# Altium schematic sheet Sheet1.SchDoc
size A0
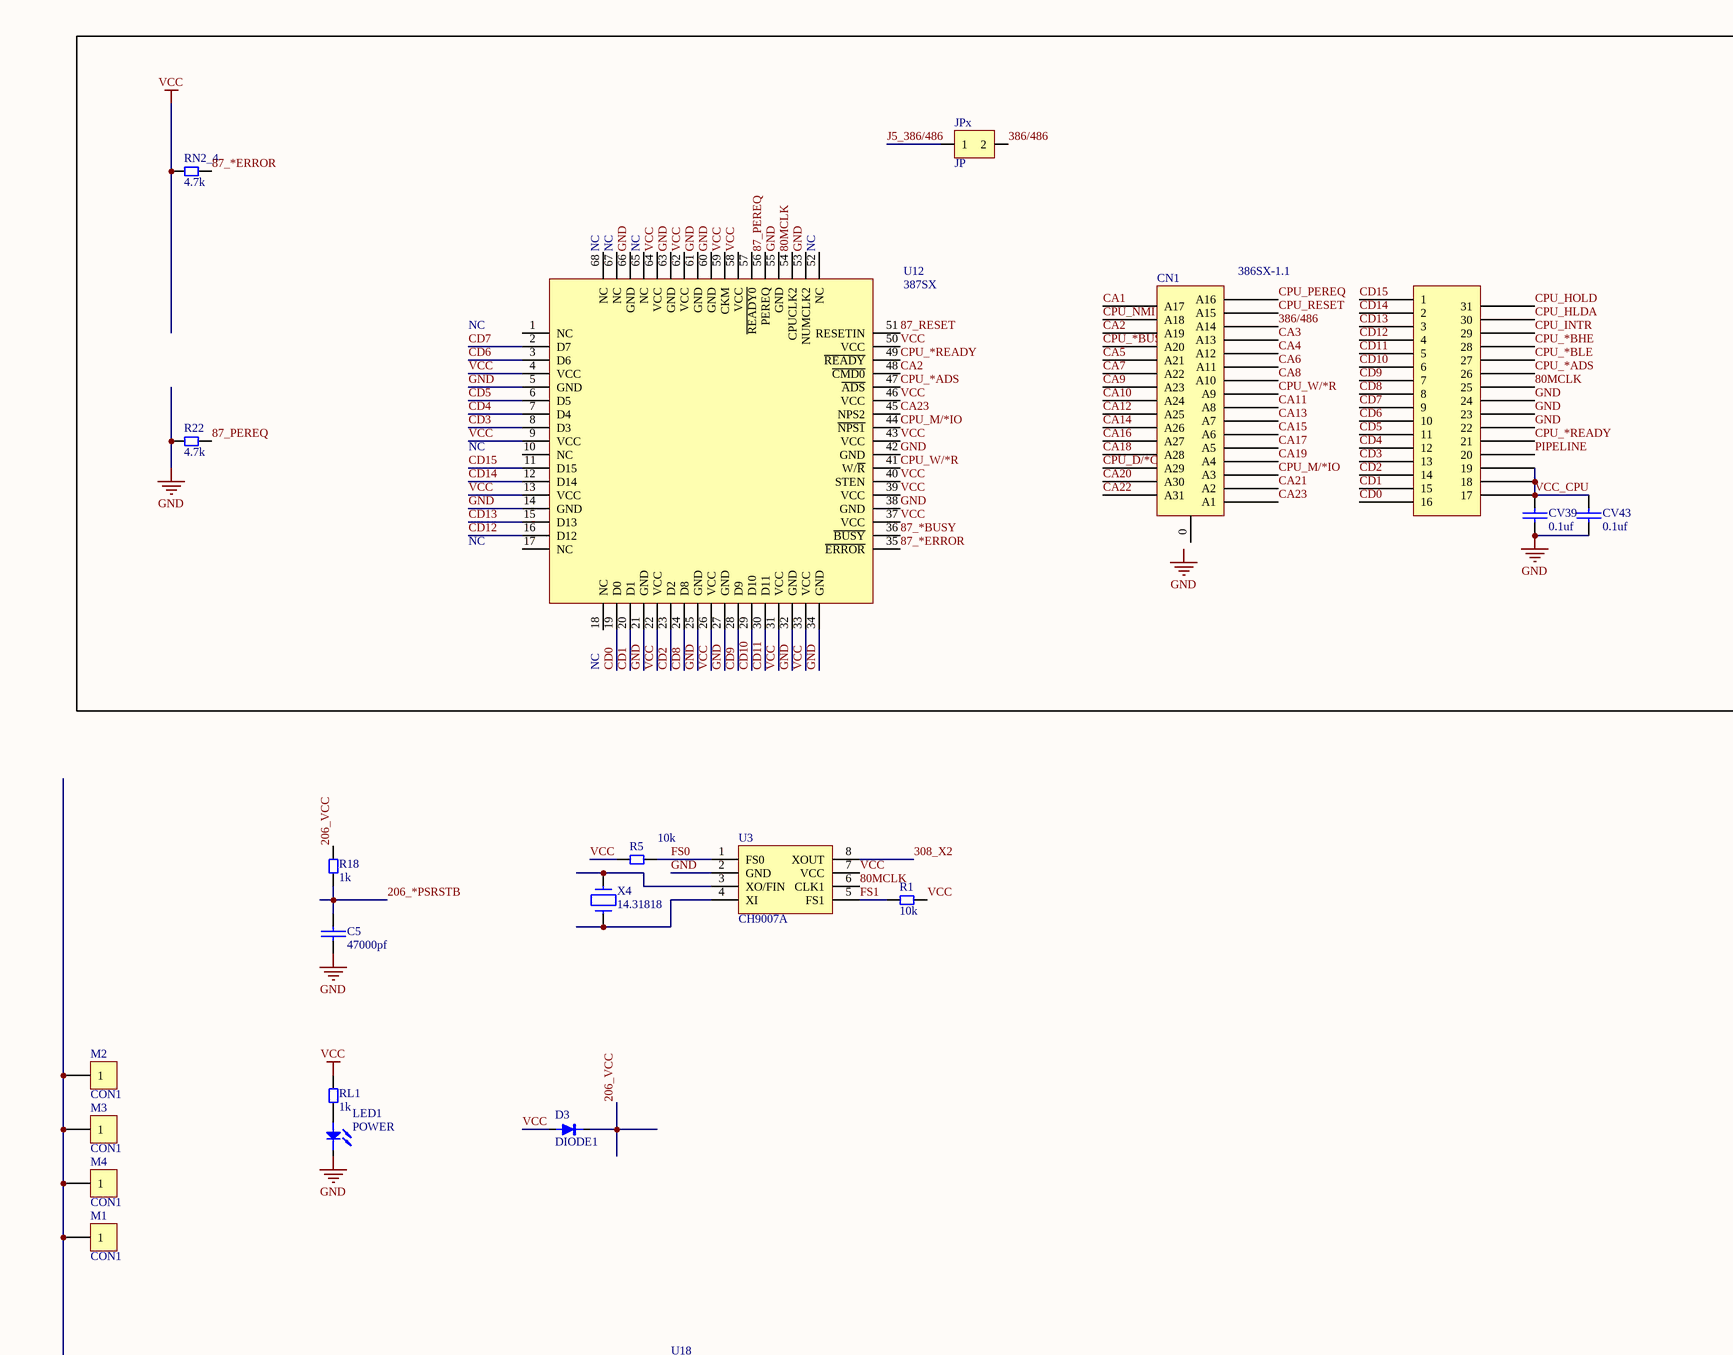
[diagram p0: Sheet1.SchDoc, top left]
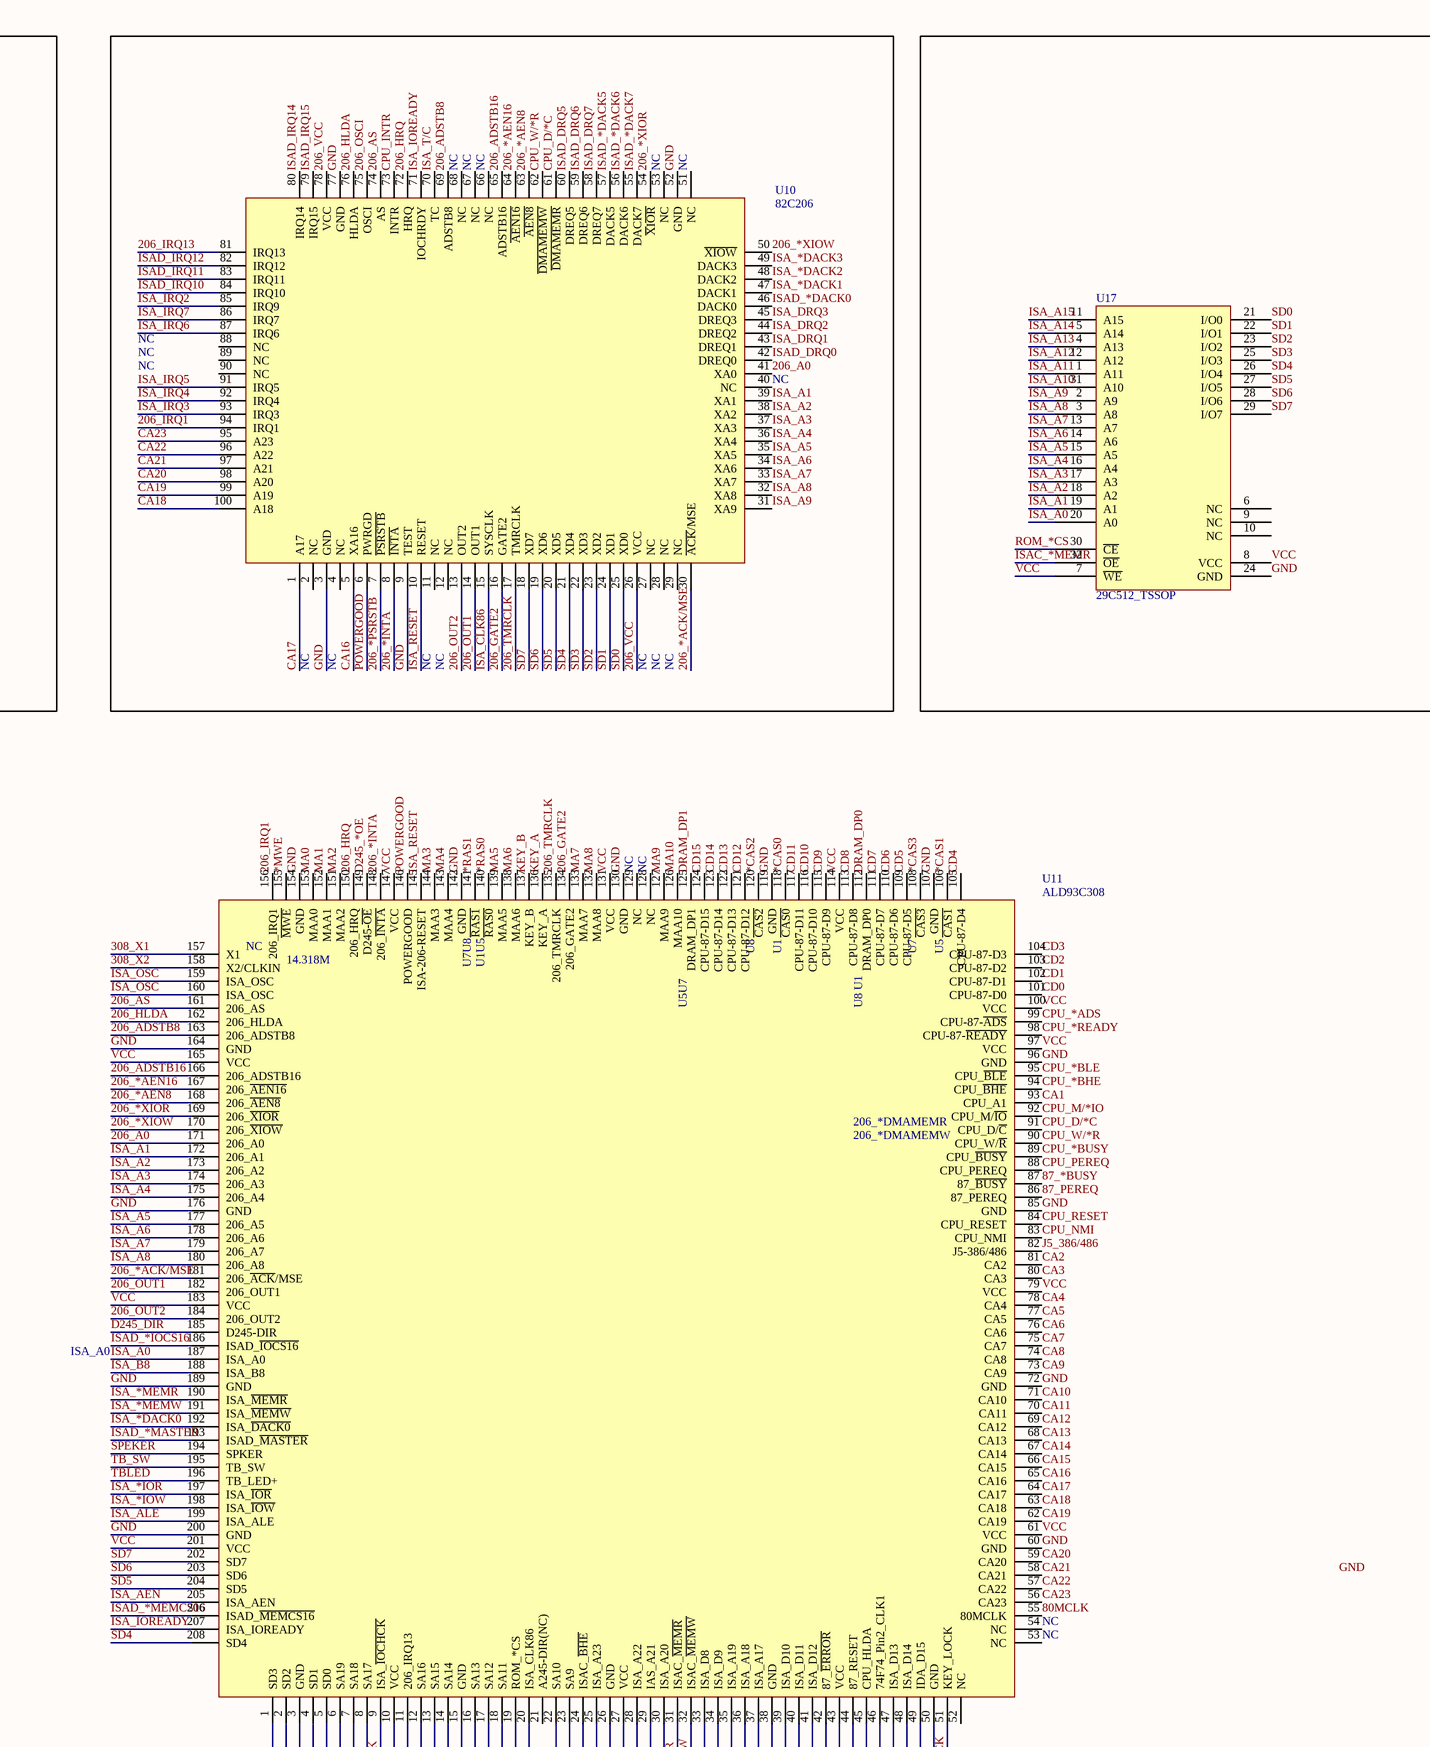
[diagram p1: Sheet1.SchDoc, top middle]
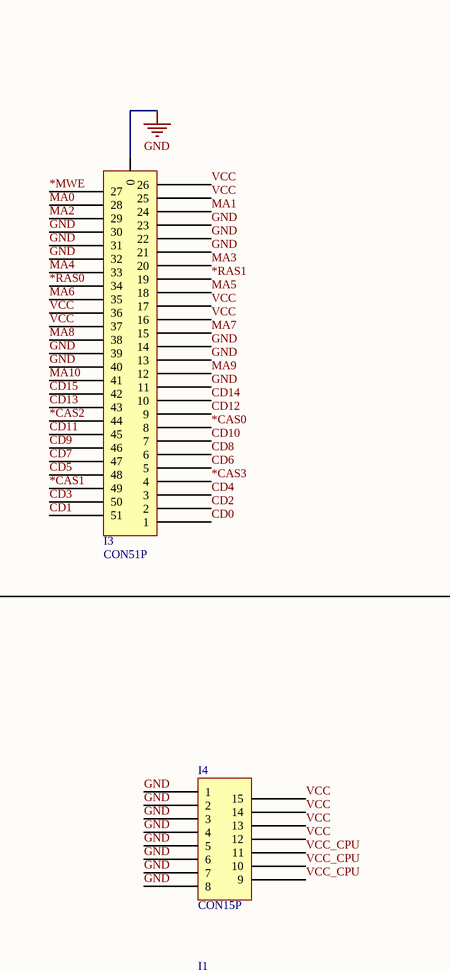
[diagram p2: Sheet1.SchDoc, top right]
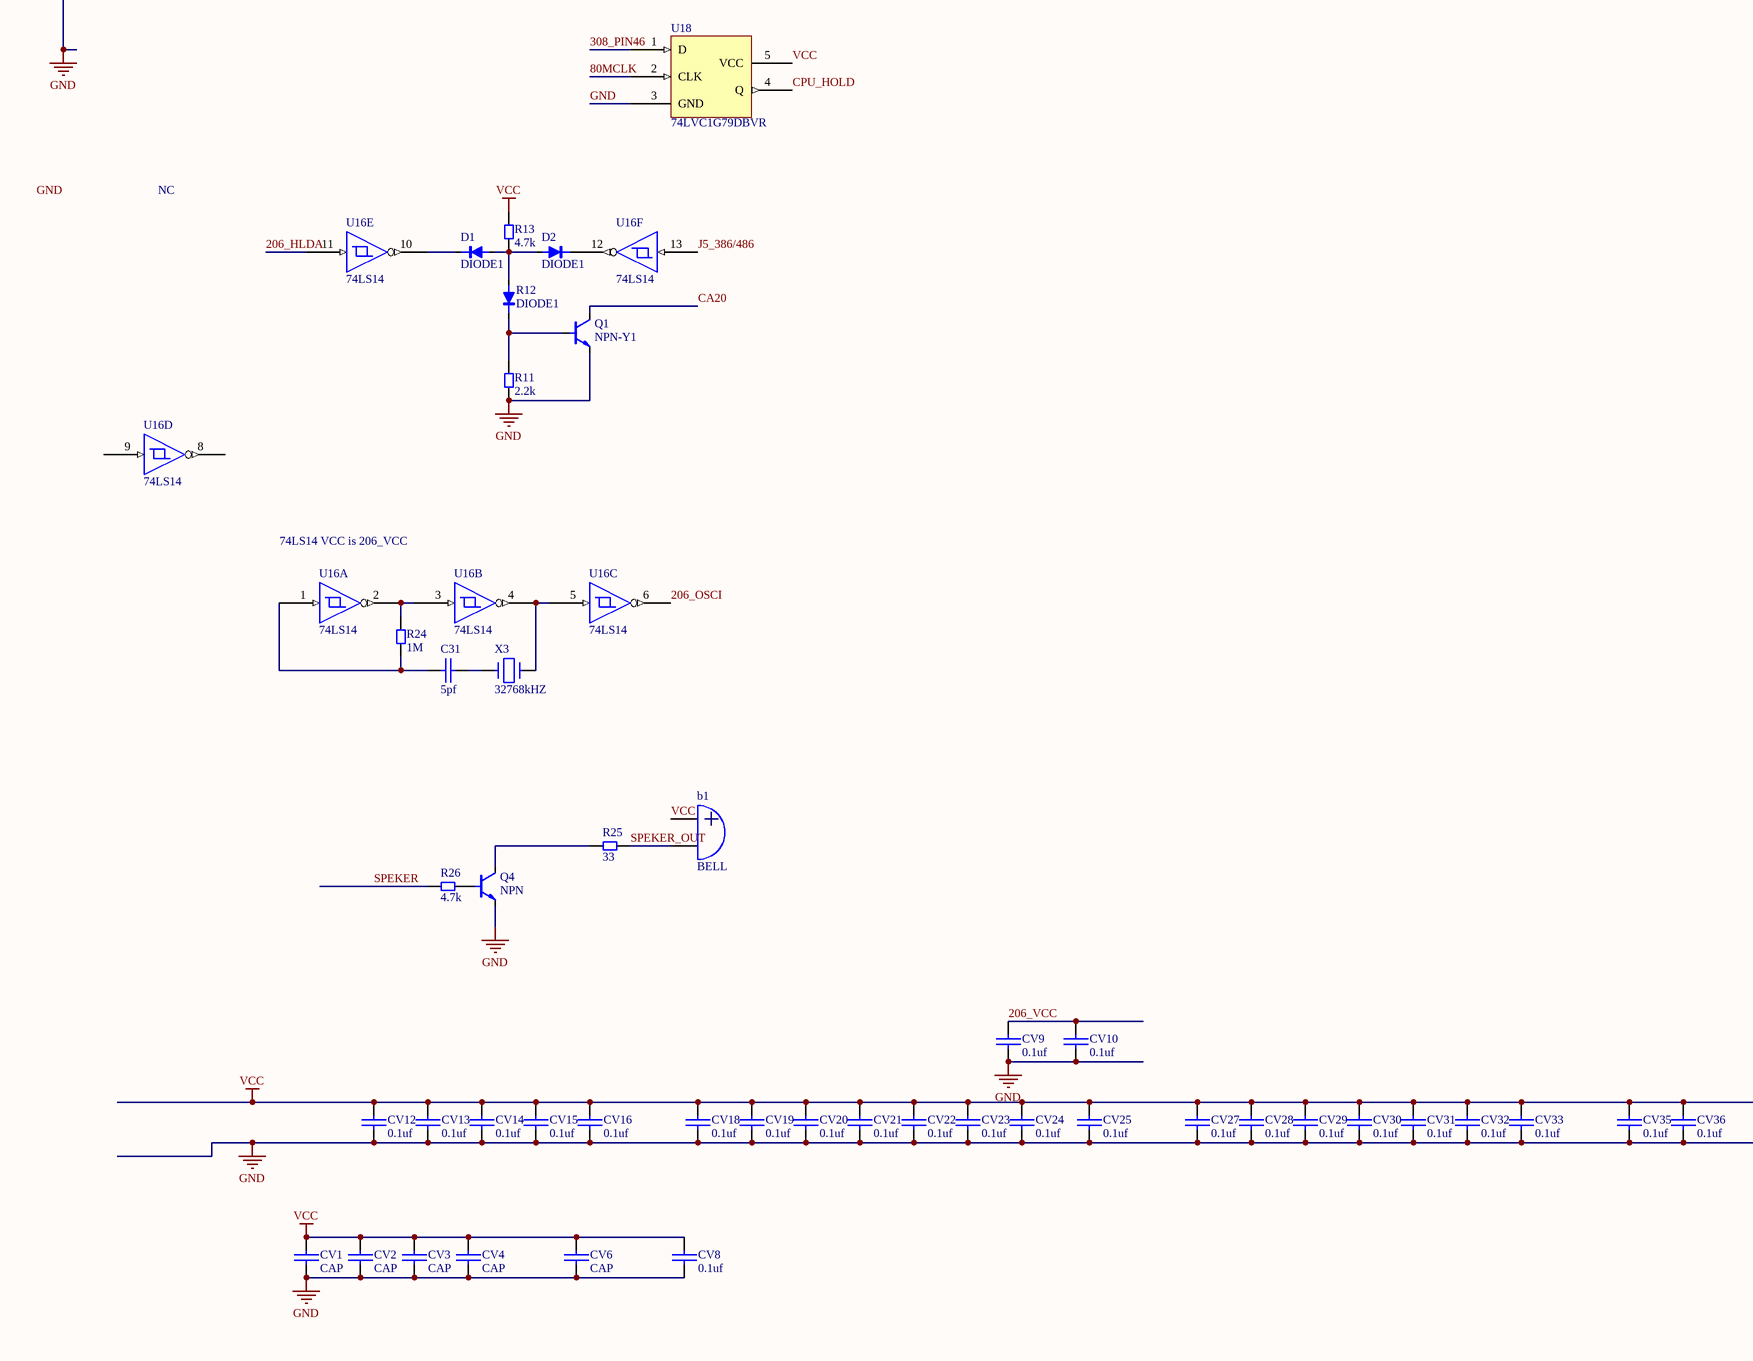
[diagram p3: Sheet1.SchDoc, bottom left]
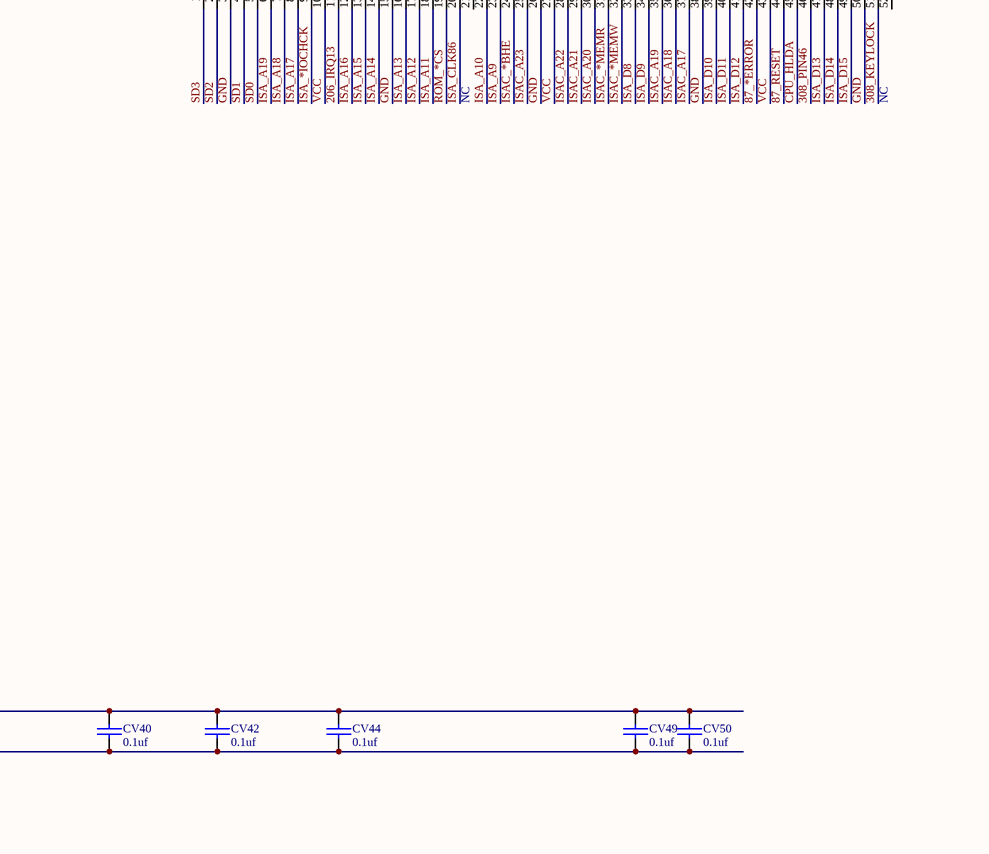
[diagram p4: Sheet1.SchDoc, bottom middle]
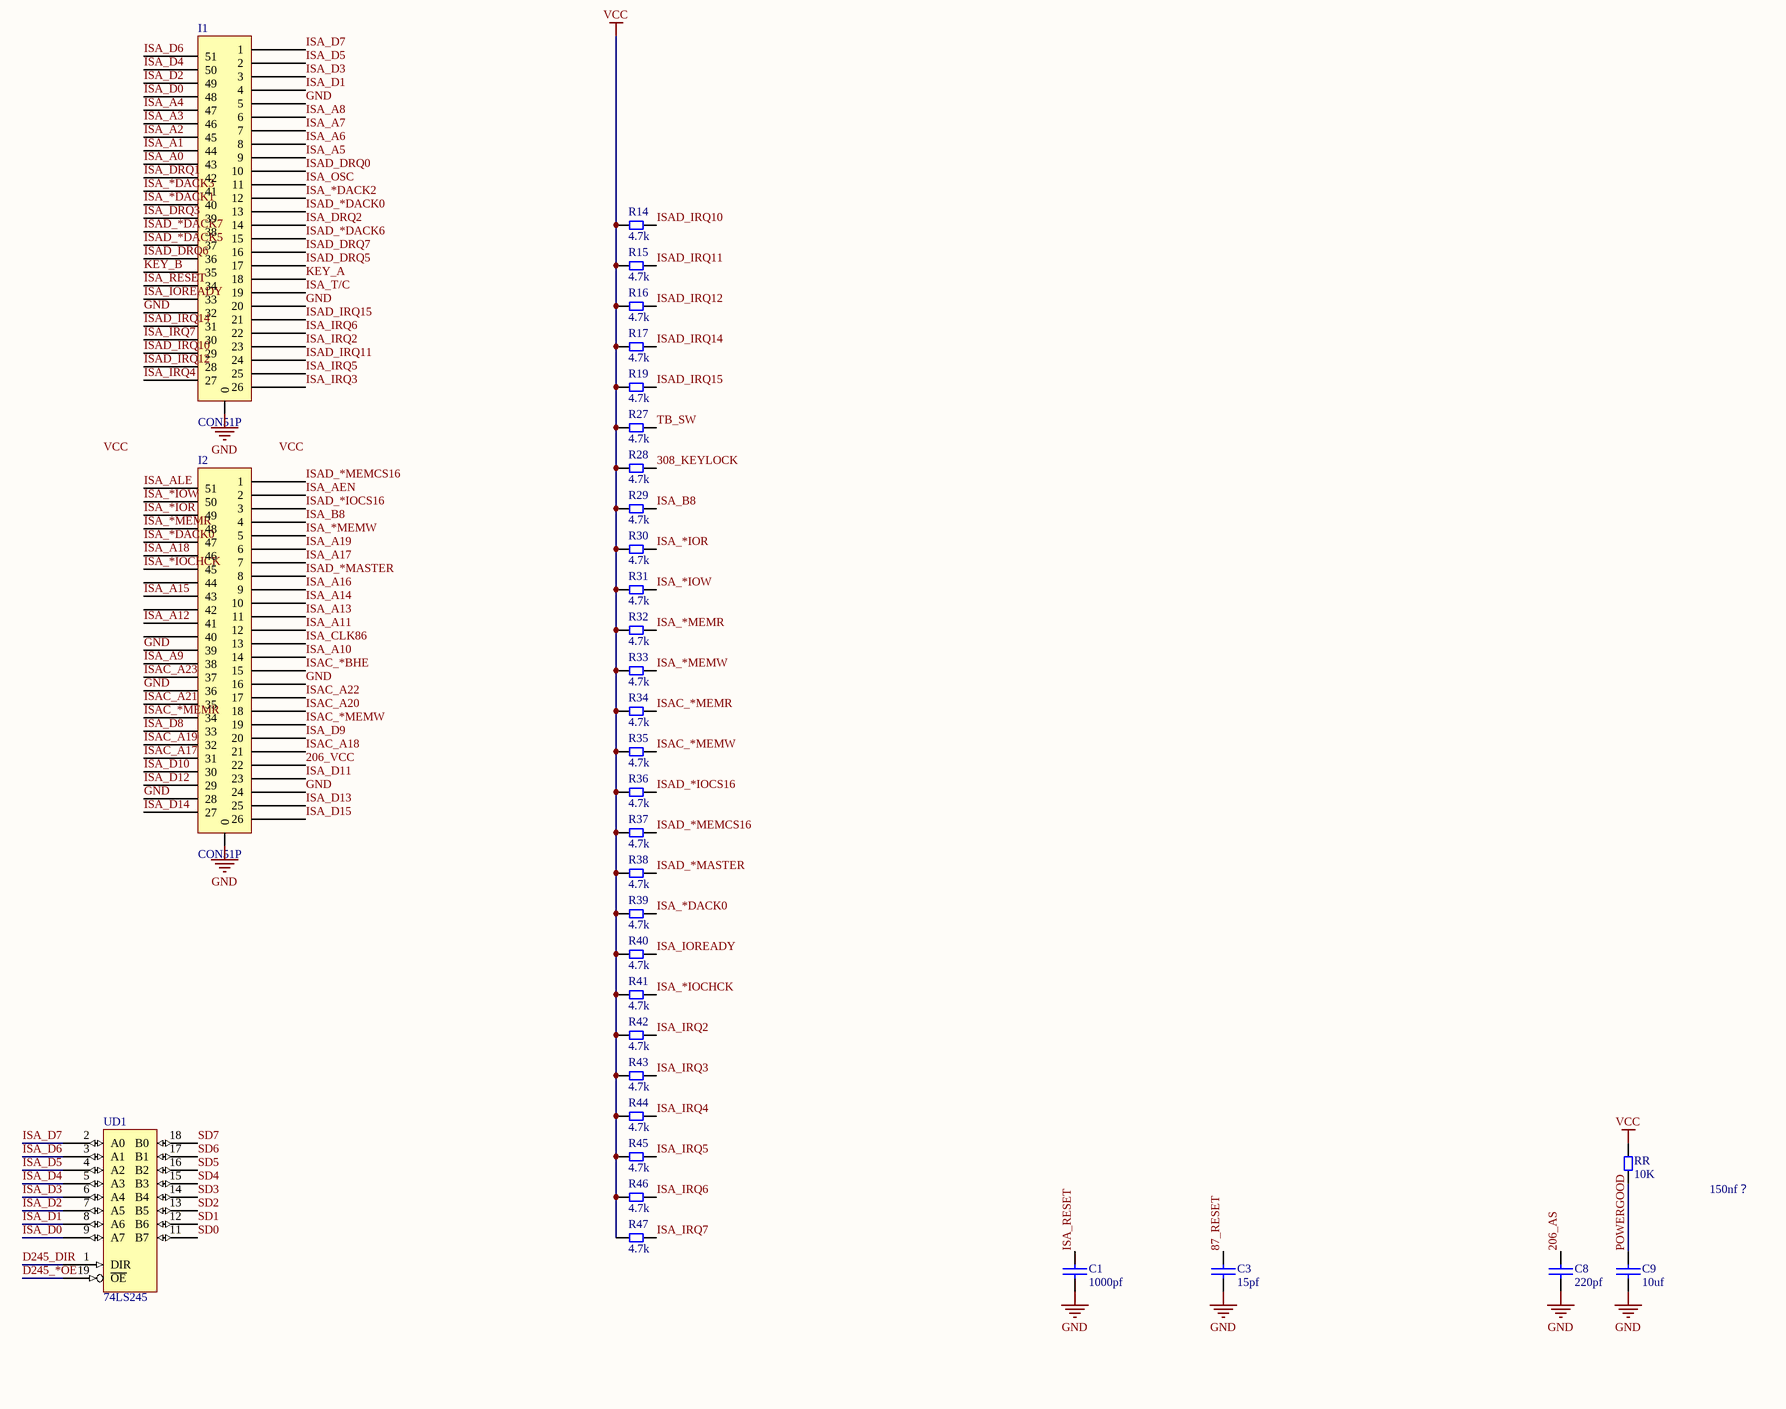
[diagram p5: Sheet1.SchDoc, bottom right]

## Parts
b1  BELL  [BELL_8530]
C1  1000pf  [C0603]
C3  15pf  [C0603]
C5  47000pf  [C0603]
C8  220pf  [C0603]
C9  10uf  [C0603]
C31  5pf  [C0603]
CN1  386SX-1.1  [MY-386SX1]
CV1  CAP  [C0805]
CV2  CAP  [C0805]
CV3  CAP  [C0805]
CV4  CAP  [C0805]
CV6  CAP  [C0805]
CV8  0.1uf  [C0603]
CV9  0.1uf  [C0603]
CV10  0.1uf  [C0603]
CV12  0.1uf  [C0603]
CV13  0.1uf  [C0603]
CV14  0.1uf  [C0603]
CV15  0.1uf  [C0603]
CV16  0.1uf  [C0603]
CV18  0.1uf  [C0603]
CV19  0.1uf  [C0603]
CV20  0.1uf  [C0603]
CV21  0.1uf  [C0603]
CV22  0.1uf  [C0603]
CV23  0.1uf  [C0603]
CV24  0.1uf  [C0603]
CV25  0.1uf  [C0603]
CV27  0.1uf  [C0603]
CV28  0.1uf  [C0603]
CV29  0.1uf  [C0603]
CV30  0.1uf  [C0603]
CV31  0.1uf  [C0603]
CV32  0.1uf  [C0603]
CV33  0.1uf  [C0603]
CV35  0.1uf  [C0603]
CV36  0.1uf  [C0603]
CV39  0.1uf  [C0603]
CV40  0.1uf  [C0603]
CV42  0.1uf  [C0603]
CV43  0.1uf  [C0603]
CV44  0.1uf  [C0603]
CV49  0.1uf  [C0603]
CV50  0.1uf  [C0603]
D1  DIODE1  [SOD323]
D2  DIODE1  [SOD323]
D3  DIODE1  [SMx]
I1  CON51P  [BTB1.0-51P-b]
I2  CON51P  [BTB1.0-51P-b]
I3  CON51P  [BTB1.0-51P-b]
I4  CON15P  [BTB1.0-15P-B]
JPx  JP  [SIP2(2.0)]
LED1  POWER  [LED0603]
M1  CON1  [M2A]
M2  CON1  [MY-M2]
M3  CON1  [MY-M2]
M4  CON1  [M2A]
Q1  NPN-Y1  [SOT23]
Q4  NPN  [SOT23]
R1  10k  [R0603]
R5  10k  [R0603]
R11  2.2k  [R0603]
R12  DIODE1  [SOD323]
R13  4.7k  [R0603]
R14  4.7k  [R0603]
R15  4.7k  [R0603]
R16  4.7k  [R0603]
R17  4.7k  [R0603]
R18  1k  [R0603]
R19  4.7k  [R0603]
R22  4.7k  [R0603]
R24  1M  [R0603]
R25  33  [R0603]
R26  4.7k  [R0603]
R27  4.7k  [R0603]
R28  4.7k  [R0603]
R29  4.7k  [R0603]
R30  4.7k  [R0603]
R31  4.7k  [R0603]
R32  4.7k  [R0603]
R33  4.7k  [R0603]
R34  4.7k  [R0603]
R35  4.7k  [R0603]
R36  4.7k  [R0603]
R37  4.7k  [R0603]
R38  4.7k  [R0603]
R39  4.7k  [R0603]
R40  4.7k  [R0603]
R41  4.7k  [R0603]
R42  4.7k  [R0603]
R43  4.7k  [R0603]
R44  4.7k  [R0603]
R45  4.7k  [R0603]
R46  4.7k  [R0603]
R47  4.7k  [R0603]
RL1  1k  [R0603]
RN2_4  4.7k  [R0603]
RR  10K  [R0603]
U3  CH9007A  [DIP8 - SOJ]
U10  82C206  [PQFP100B]
U11  ALD93C308
U12  387SX  [PLCC68]
U16  74LS14  [SO-14]  (parts A,B,C,D,E,F of 6)
U17  29C512_TSSOP  [TSSOP32]
U18  74LVC1G79DBVR  [SOT23-5]
UD1  74LS245  [TSSOP-20]
X3  32768kHZ  [CRY3215A]
X4  14.31818  [5032]

## Nets
GND: C1.2 C3.2 C5.1 C8.2 C9.2 CN1.22 CN1.23 CN1.24 CV1.2 CV2.2 CV3.2 CV4.2 CV6.2 CV8.2 CV9.2 CV10.2 CV12.2 CV13.2 CV14.2 CV15.2 CV16.2 CV18.2 CV19.2 CV20.2 CV21.2 CV22.2 CV23.2 CV24.2 CV25.2 CV27.2 CV28.2 CV29.2 CV30.2 CV31.2 CV32.2 CV33.2 CV35.2 CV36.2 CV39.2 CV40.2 CV42.2 CV43.2 CV44.2 CV49.2 CV50.2 I1.0 I1.5 I1.20 I1.32 I2.0 I2.16 I2.24 I2.28 I2.36 I2.39 I3.0 I3.11 I3.13 I3.14 I3.21 I3.22 I3.23 I3.30 I3.31 I3.32 I3.39 I3.40 I4.1 I4.2 I4.3 I4.4 I4.5 I4.6 I4.7 I4.8 LED1.2 M1.1 M2.1 M3.1 M4.1 Q1.E(e) Q4.E(e) R11.1 R22.1 U3.2(GND) U10.3(GND) U10.9(TEST) U10.52(GND) U10.77(GND) U11.3(GND) U11.15(GND) U11.26(GND) U11.38(GND) U11.50(GND) U11.60(GND) U11.72(GND) U11.85(GND) U11.96(GND) U11.107(GND) U11.119(GND) U11.130(GND) U11.142(GND) U11.154(GND) U11.164(GND) U11.176(GND) U11.189(GND) U11.200(GND) U12.5(GND) U12.14(GND) U12.21(GND) U12.25(GND) U12.27(GND) U12.32(GND) U12.34(GND) U12.38(GND) U12.42(GND) U12.53(NUMCLK2) U12.55(GND) U12.60(GND) U12.61(GND) U12.63(GND) U12.66(GND) U16.7(GND) U17.24(GND) U18.3(GND) UD1.10(GND)
VCC: b1.1 CV1.1 CV2.1 CV3.1 CV4.1 CV6.1 CV8.1 CV12.1 CV13.1 CV14.1 CV15.1 CV16.1 CV18.1 CV19.1 CV20.1 CV21.1 CV22.1 CV23.1 CV24.1 CV25.1 CV27.1 CV28.1 CV29.1 CV30.1 CV31.1 CV32.1 CV33.1 CV35.1 CV36.1 CV40.1 CV42.1 CV44.1 CV49.1 CV50.1 D3.A I3.16 I3.17 I3.25 I3.26 I3.36 I3.37 I4.12 I4.13 I4.14 I4.15 R1.2 R5.2 R13.1 R14.1 R15.1 R16.1 R17.1 R19.1 R27.1 R28.1 R29.1 R30.1 R31.1 R32.1 R33.1 R34.1 R35.1 R36.1 R37.1 R38.1 R39.1 R40.1 R41.1 R42.1 R43.1 R44.1 R45.1 R46.1 R47.1 RL1.2 RN2_4.2 RR.2 U3.7(VCC) U11.10(VCC) U11.27(VCC) U11.43(VCC) U11.61(VCC) U11.79(VCC) U11.97(VCC) U11.100(VCC) U11.114(VCC) U11.131(VCC) U11.147(VCC) U11.165(VCC) U11.183(VCC) U11.201(VCC) U12.4(VCC) U12.9(VCC) U12.13(VCC) U12.22(VCC) U12.26(VCC) U12.31(VCC) U12.33(VCC) U12.37(VCC) U12.39(VCC) U12.40(STEN) U12.43(VCC) U12.46(VCC) U12.50(VCC) U12.58(VCC) U12.59(CKM) U12.62(VCC) U12.64(VCC) U16.14(VCC) U17.7(~{WE}) U17.8(VCC) U18.5(VCC) UD1.20(VCC)
80MCLK: CN1.25 U3.6(CLK1) U11.55(80MCLK) U12.54(CPUCLK2) U18.2(CLK)
87_*BUSY: U11.87(87_~{BUSY}) U12.36(~{BUSY})
87_*ERROR: RN2_4.1 U11.42(87_~{ERROR}) U12.35(~{ERROR})
87_PEREQ: R22.2 U11.86(87_PEREQ) U12.56(PEREQ)
87_RESET: C3.1 U11.44(87_RESET) U12.51(RESETIN)
206_*ACK/MSE: U10.30(~{ACK}/MSE) U11.181(206_~{ACK}/MSE)
206_*AEN8: U10.63(~{AEN8}) U11.168(206_~{AEN8})
206_*AEN16: U10.64(~{AEN16}) U11.167(206_~{AEN16})
206_*INTA: U10.8(~{INTA}) U11.148(206_~{INTA})
206_*PSRSTB: C5.2 R18.1 U10.7(~{PSRSTB})
206_*XIOR: U10.54(~{X}I~{OR}) U11.169(206_~{XIOR})
206_*XIOW: U10.50(~{XIOW}) U11.170(206_~{XIOW})
206_A0: U10.41(XA0) U11.171(206_A0)
206_ADSTB8: U10.69(ADSTB8) U11.163(206_ADSTB8)
206_ADSTB16: U10.65(ADSTB16) U11.166(206_ADSTB16)
206_AS: C8.1 U10.74(AS) U11.161(206_AS)
206_GATE2: U10.16(GATE2) U11.134(206_GATE2)
206_HLDA: U10.76(HLDA) U11.162(206_HLDA) U16.11
206_HRQ: U10.72(HRQ) U11.150(206_HRQ)
206_IRQ1: U10.94(IRQ1) U11.156(206_IRQ1)
206_IRQ13: U10.81(IRQ13) U11.11(206_IRQ13)
206_OSCI: U10.75(OSCI) U16.6
206_OUT1: U10.14(OUT1) U11.182(206_OUT1)
206_OUT2: U10.13(OUT2) U11.184(206_OUT2)
206_TMRCLK: U10.17(TMRCLK) U11.135(206_TMRCLK)
206_VCC: CV9.1 CV10.1 D3.K I2.22 R18.2 U10.26(VCC) U10.78(VCC)
308_KEYLOCK: R28.2 U11.51(KEY_LOCK)
308_PIN46: U11.46(74F74_Pin2_CLK1) U18.1(D)
308_X1: U11.157(X1)
308_X2: U3.8(XOUT) U11.158(X2/CLKIN)
386/486: CN1.A14 JPx.2
*CAS0: I3.8 U11.118(~{CAS0})
*CAS1: I3.49 U11.106(~{CAS1})
*CAS2: I3.44 U11.120(~{CAS2})
*CAS3: I3.4 U11.108(~{CAS3})
*MWE: I3.27 U11.155(~{MWE})
*RAS0: I3.34 U11.140(~{RAS0})
*RAS1: I3.19 U11.141(~{RAS1})
CA1: CN1.A17 U11.93(CPU_A1)
CA2: CN1.A19 U11.81(CA2) U12.48(~{CMD0})
CA3: CN1.A13 U11.80(CA3)
CA4: CN1.A12 U11.78(CA4)
CA5: CN1.A21 U11.77(CA5)
CA6: CN1.A11 U11.76(CA6)
CA7: CN1.A22 U11.75(CA7)
CA8: CN1.A10 U11.74(CA8)
CA9: CN1.A23 U11.73(CA9)
CA10: CN1.A24 U11.71(CA10)
CA11: CN1.A8 U11.70(CA11)
CA12: CN1.A25 U11.69(CA12)
CA13: CN1.A7 U11.68(CA13)
CA14: CN1.A26 U11.67(CA14)
CA15: CN1.A6 U11.66(CA15)
CA16: CN1.A27 U10.5(XA16) U11.65(CA16)
CA17: CN1.A5 U10.1(A17) U11.64(CA17)
CA18: CN1.A28 U10.100(A18) U11.63(CA18)
CA19: CN1.A4 U10.99(A19) U11.62(CA19)
CA20: CN1.A30 Q1.C(c) U10.98(A20) U11.59(CA20)
CA21: CN1.A2 U10.97(A21) U11.58(CA21)
CA22: CN1.A31 U10.96(A22) U11.57(CA22)
CA23: CN1.A1 U10.95(A23) U11.56(CA23) U12.45(NPS2)
CD0: CN1.16 I3.1 U11.101(CPU-87-D0) U12.19(D0)
CD1: CN1.15 I3.51 U11.102(CPU-87-D1) U12.20(D1)
CD2: CN1.14 I3.2 U11.103(CPU-87-D2) U12.23(D2)
CD3: CN1.13 I3.50 U11.104(CPU-87-D3) U12.8(D3)
CD4: CN1.12 I3.3 U11.105(CPU-87-D4) U12.7(D4)
CD5: CN1.11 I3.48 U11.109(CPU-87-D5) U12.6(D5)
CD6: CN1.10 I3.5 U11.110(CPU-87-D6) U12.3(D6)
CD7: CN1.9 I3.47 U11.111(CPU-87-D7) U12.2(D7)
CD8: CN1.8 I3.6 U11.113(CPU-87-D8) U12.24(D8)
CD9: CN1.7 I3.46 U11.115(CPU-87-D9) U12.28(D9)
CD10: CN1.6 I3.7 U11.116(CPU-87-D10) U12.29(D10)
CD11: CN1.5 I3.45 U11.117(CPU-87-D11) U12.30(D11)
CD12: CN1.4 I3.9 U11.121(CPU-87-D12) U12.16(D12)
CD13: CN1.3 I3.43 U11.122(CPU-87-D13) U12.15(D13)
CD14: CN1.2 I3.10 U11.123(CPU-87-D14) U12.12(D14)
CD15: CN1.1 I3.42 U11.124(CPU-87-D15) U12.11(D15)
CPU_*ADS: CN1.26 U11.99(CPU-87-~{ADS}) U12.47(~{ADS})
CPU_*BHE: CN1.28 U11.94(CPU_~{BHE})
CPU_*BLE: CN1.27 U11.95(CPU_~{BLE})
CPU_*BUSY: CN1.A20 U11.89(CPU_~{BUSY})
CPU_*READY: CN1.21 U11.98(CPU-87-~{READY}) U12.49(~{READY})
CPU_D/*C: CN1.A29 U10.61(~{DMAMEMR}) U11.91(CPU_D/~{C})
CPU_HLDA: CN1.30 U11.45(CPU_HLDA)
CPU_HOLD: CN1.31 U18.4(Q)
CPU_INTR: CN1.29 U10.73(INTR)
CPU_M/*IO: CN1.A3 U11.92(CPU_M/~{IO}) U12.44(~{NPS1})
CPU_NMI: CN1.A18 U11.83(CPU_NMI)
CPU_PEREQ: CN1.A16 U11.88(CPU_PEREQ)
CPU_RESET: CN1.A15 U11.84(CPU_RESET)
CPU_W/*R: CN1.A9 U10.62(~{DMAMEMW}) U11.90(CPU_W/~{R}) U12.41(W/~{R})
D245_*OE: U11.149(D245-~{OE}) UD1.19(~{OE})
D245_DIR: U11.185(D245-DIR) UD1.1(DIR)
DRAM_DP0: U11.112(DRAM_DP0)
DRAM_DP1: U11.125(DRAM_DP1)
FS0: R5.1 U3.1(FS0)
FS1: R1.1 U3.5(FS1)
ISA_*DACK0: I2.47 R39.2 U11.192(ISA_~{DACK0})
ISA_*DACK1: I1.40 U10.47(DACK1)
ISA_*DACK2: I1.12 U10.48(DACK2)
ISA_*DACK3: I1.41 U10.49(DACK3)
ISA_*IOCHCK: I2.45 R41.2 U11.9(ISA_~{IOCHCK})
ISA_*IOR: I2.49 R30.2 U11.197(ISA_~{IOR})
ISA_*IOW: I2.50 R31.2 U11.198(ISA_~{IOW})
ISA_*MEMR: I2.48 R32.2 U11.190(ISA_~{MEMR})
ISA_*MEMW: I2.5 R33.2 U11.191(ISA_~{MEMW})
ISA_A0: I1.43 U11.187(ISA_A0) U17.20(A0)
ISA_A1: I1.44 U10.39(XA1) U11.172(206_A1) U17.19(A1)
ISA_A2: I1.45 U10.38(XA2) U11.173(206_A2) U17.18(A2)
ISA_A3: I1.46 U10.37(XA3) U11.174(206_A3) U17.17(A3)
ISA_A4: I1.47 U10.36(XA4) U11.175(206_A4) U17.16(A4)
ISA_A5: I1.9 U10.35(XA5) U11.177(206_A5) U17.15(A5)
ISA_A6: I1.8 U10.34(XA6) U11.178(206_A6) U17.14(A6)
ISA_A7: I1.7 U10.33(XA7) U11.179(206_A7) U17.13(A7)
ISA_A8: I1.6 U10.32(XA8) U11.180(206_A8) U17.3(A8)
ISA_A9: I2.38 U10.31(XA9) U11.23(SA9) U17.2(A9)
ISA_A10: I2.14 U11.22(SA10) U17.31(A10)
ISA_A11: I2.12 U11.18(SA11) U17.1(A11)
ISA_A12: I2.41 U11.17(SA12) U17.12(A12)
ISA_A13: I2.11 U11.16(SA13) U17.4(A13)
ISA_A14: I2.10 U11.14(SA14) U17.5(A14)
ISA_A15: I2.43 U11.13(SA15) U17.11(A15)
ISA_A16: I2.9 U11.12(SA16)
ISA_A17: I2.7 U11.8(SA17)
ISA_A18: I2.46 U11.7(SA18)
ISA_A19: I2.6 U11.6(SA19)
ISA_AEN: I2.2 U11.205(ISA_AEN)
ISA_ALE: I2.51 U11.199(ISA_ALE)
ISA_B8: I2.4 R29.2 U11.188(ISA_B8)
ISA_CLK86: I2.13 U10.15(SYSCLK) U11.20(ISA_CLK86)
ISA_D0: I1.48 UD1.9(A7)
ISA_D1: I1.4 UD1.8(A6)
ISA_D2: I1.49 UD1.7(A5)
ISA_D3: I1.3 UD1.6(A4)
ISA_D4: I1.50 UD1.5(A3)
ISA_D5: I1.2 UD1.4(A2)
ISA_D6: I1.51 UD1.3(A1)
ISA_D7: I1.1 UD1.2(A0)
ISA_D8: I2.33 U11.33(ISA_D8)
ISA_D9: I2.20 U11.34(ISA_D9)
ISA_D10: I2.30 U11.39(ISA_D10)
ISA_D11: I2.23 U11.40(ISA_D11)
ISA_D12: I2.29 U11.41(ISA_D12)
ISA_D13: I2.25 U11.47(ISA_D13)
ISA_D14: I2.27 U11.48(ISA_D14)
ISA_D15: I2.26 U11.49(IDA_D15)
ISA_DRQ1: I1.42 U10.43(DREQ1)
ISA_DRQ2: I1.14 U10.44(DREQ2)
ISA_DRQ3: I1.39 U10.45(DREQ3)
ISA_IOREADY: I1.33 R40.2 U10.71(IOCHRDY) U11.207(ISA_IOREADY)
ISA_IRQ2: I1.23 R42.2 U10.85(IRQ9)
ISA_IRQ3: I1.26 R43.2 U10.93(IRQ3)
ISA_IRQ4: I1.27 R44.2 U10.92(IRQ4)
ISA_IRQ5: I1.25 R45.2 U10.91(IRQ5)
ISA_IRQ6: I1.22 R46.2 U10.87(IRQ6)
ISA_IRQ7: I1.30 R47.2 U10.86(IRQ7)
ISA_OSC: I1.11 U11.159(ISA_OSC) U11.160(ISA_OSC)
ISA_RESET: C1.1 I1.34 U10.10(RESET) U11.145(ISA-206-RESET)
ISA_T/C: I1.19 U10.70(TC)
ISAC_*BHE: I2.15 U11.24(ISAC_~{BHE})
ISAC_*MEMR: I2.34 R34.2 U11.31(ISAC_~{MEMR}) U17.32(~{OE})
ISAC_*MEMW: I2.19 R35.2 U11.32(ISAC_~{MEMW})
ISAC_A17: I2.31 U11.37(ISA_A17)
ISAC_A18: I2.21 U11.36(ISA_A18)
ISAC_A19: I2.32 U11.35(ISA_A19)
ISAC_A20: I2.18 U11.30(ISA_A20)
ISAC_A21: I2.35 U11.29(IAS_A21)
ISAC_A22: I2.17 U11.28(ISA_A22)
ISAC_A23: I2.37 U11.25(ISA_A23)
ISAD_*DACK0: I1.13 U10.46(DACK0)
ISAD_*DACK5: I1.37 U10.57(DACK5)
ISAD_*DACK6: I1.15 U10.56(DACK6)
ISAD_*DACK7: I1.38 U10.55(DACK7)
ISAD_*IOCS16: I2.3 R36.2 U11.186(ISAD_~{IOCS16})
ISAD_*MASTER: I2.8 R38.2 U11.193(ISAD_~{MASTER})
ISAD_*MEMCS16: I2.1 R37.2 U11.206(ISAD_~{MEMCS16})
ISAD_DRQ0: I1.10 U10.42(DREQ0)
ISAD_DRQ5: I1.17 U10.60(DREQ5)
ISAD_DRQ6: I1.36 U10.59(DREQ6)
ISAD_DRQ7: I1.16 U10.58(DREQ7)
ISAD_IRQ10: I1.29 R14.2 U10.84(IRQ10)
ISAD_IRQ11: I1.24 R15.2 U10.83(IRQ11)
ISAD_IRQ12: I1.28 R16.2 U10.82(IRQ12)
ISAD_IRQ14: I1.31 R17.2 U10.80(IRQ14)
ISAD_IRQ15: I1.21 R19.2 U10.79(IRQ15)
J5_386/486: JPx.1 U11.82(J5-386/486) U16.13
KEY_A: I1.18 U11.136(KEY_A)
KEY_B: I1.35 U11.137(KEY_B)
MA0: I3.28 U11.153(MAA0)
MA1: I3.24 U11.152(MAA1)
MA2: I3.29 U11.151(MAA2)
MA3: I3.20 U11.144(MAA3)
MA4: I3.33 U11.143(MAA4)
MA5: I3.18 U11.139(MAA5)
MA6: I3.35 U11.138(MAA6)
MA7: I3.15 U11.133(MAA7)
MA8: I3.38 U11.132(MAA8)
MA9: I3.12 U11.127(MAA9)
MA10: I3.41 U11.126(MAA10)
PIPELINE: CN1.20
POWERGOOD: C9.1 RR.1 U10.6(PWRGD) U11.146(POWERGOOD)
ROM_*CS: U11.19(ROM_*CS) U17.30(~{CE})
SD0: U10.25(XD0) U11.5(SD0) U17.21(I/O0) UD1.11(B7)
SD1: U10.24(XD1) U11.4(SD1) U17.22(I/O1) UD1.12(B6)
SD2: U10.23(XD2) U11.2(SD2) U17.23(I/O2) UD1.13(B5)
SD3: U10.22(XD3) U11.1(SD3) U17.25(I/O3) UD1.14(B4)
SD4: U10.21(XD4) U11.208(SD4) U17.26(I/O4) UD1.15(B3)
SD5: U10.20(XD5) U11.204(SD5) U17.27(I/O5) UD1.16(B2)
SD6: U10.19(XD6) U11.203(SD6) U17.28(I/O6) UD1.17(B1)
SD7: U10.18(XD7) U11.202(SD7) U17.29(I/O7) UD1.18(B0)
SPEKER: R26.2 U11.194(SPKER)
SPEKER_OUT: b1.2 R25.2
TB_SW: R27.2 U11.195(TB_SW)
TBLED: U11.196(TB_LED+)
VCC_CPU: CN1.17 CN1.18 CN1.19 CV39.1 CV43.1 I4.9 I4.10 I4.11
NetC31_1: C31.1 R24.1 U16.1
NetC31_2: C31.2 X3.2
NetD1_A: D1.A D2.A R12.A R13.2
NetD1_K: D1.K U16.10
NetD2_K: D2.K U16.12
NetLED1_1: LED1.1 RL1.1
NetQ1_B: Q1.B(b) R11.2 R12.K
NetQ4_B: Q4.B(b) R26.1
NetQ4_C: Q4.C(c) R25.1
NetR24_2: R24.2 U16.2 U16.3
NetU3_3: U3.3(XO/FIN) X4.1
NetU3_4: U3.4(XI) X4.2
NetU16_4: U16.4 U16.5 X3.1

Not connected (* = marked no-connect by the designer): CN1 0; I2 40 42 44; U10 2(NC) 4(NC) 11(NC) 12(NC) 27(NC) 28(NC) 29(NC) 40(NC) 51(NC) 53(NC) 66(NC) 67(NC) 68(NC) 88(NC) 89(NC) 90(NC); U11 21(A245-DIR(NC)) 52(NC) 53(NC) 54(NC) 128(NC) 129(NC); U12 1(NC) 10(NC) 17(NC) 18(NC) 52(NC) 57(~{READY0}) 65(NC) 67(NC) 68(NC); U16 8 9; U17 6(NC) 9(NC) 10(NC)

## Notes on the sheet
- (near U10) NC
- (near U12) NC
- NC
- (near U11) NC
- ISA_A0
- 74LS14 VCC is 206_VCC
- 150nf？
- Labels drawn without touching a wire or pin: GND, VCC
- (in symbol ALD93C308) U8; U1; U7; U5; 14.318M; U7U8; U1U5; U5U7; U8 U1; 206_*DMAMEMR; 206_*DMAMEMW

## Library data of the parts
C1 C3 C5 C8 C9 C31 CV8-CV10 CV12-CV16 CV18-CV25 CV27-CV33 CV35 CV36 CV39 CV40 CV42-CV44 CV49 CV50 = CAP
JPx = JP-2
LED1 = LED
Q1 = NPN
R1 R5 R11 R13-R19 R22 R24-R47 RL1 RN2_4 RR = RES2
X3 X4 = CRYSTAL